# EAGLE design Adafruit SWD Breakout (EAGLE 6.6.0)
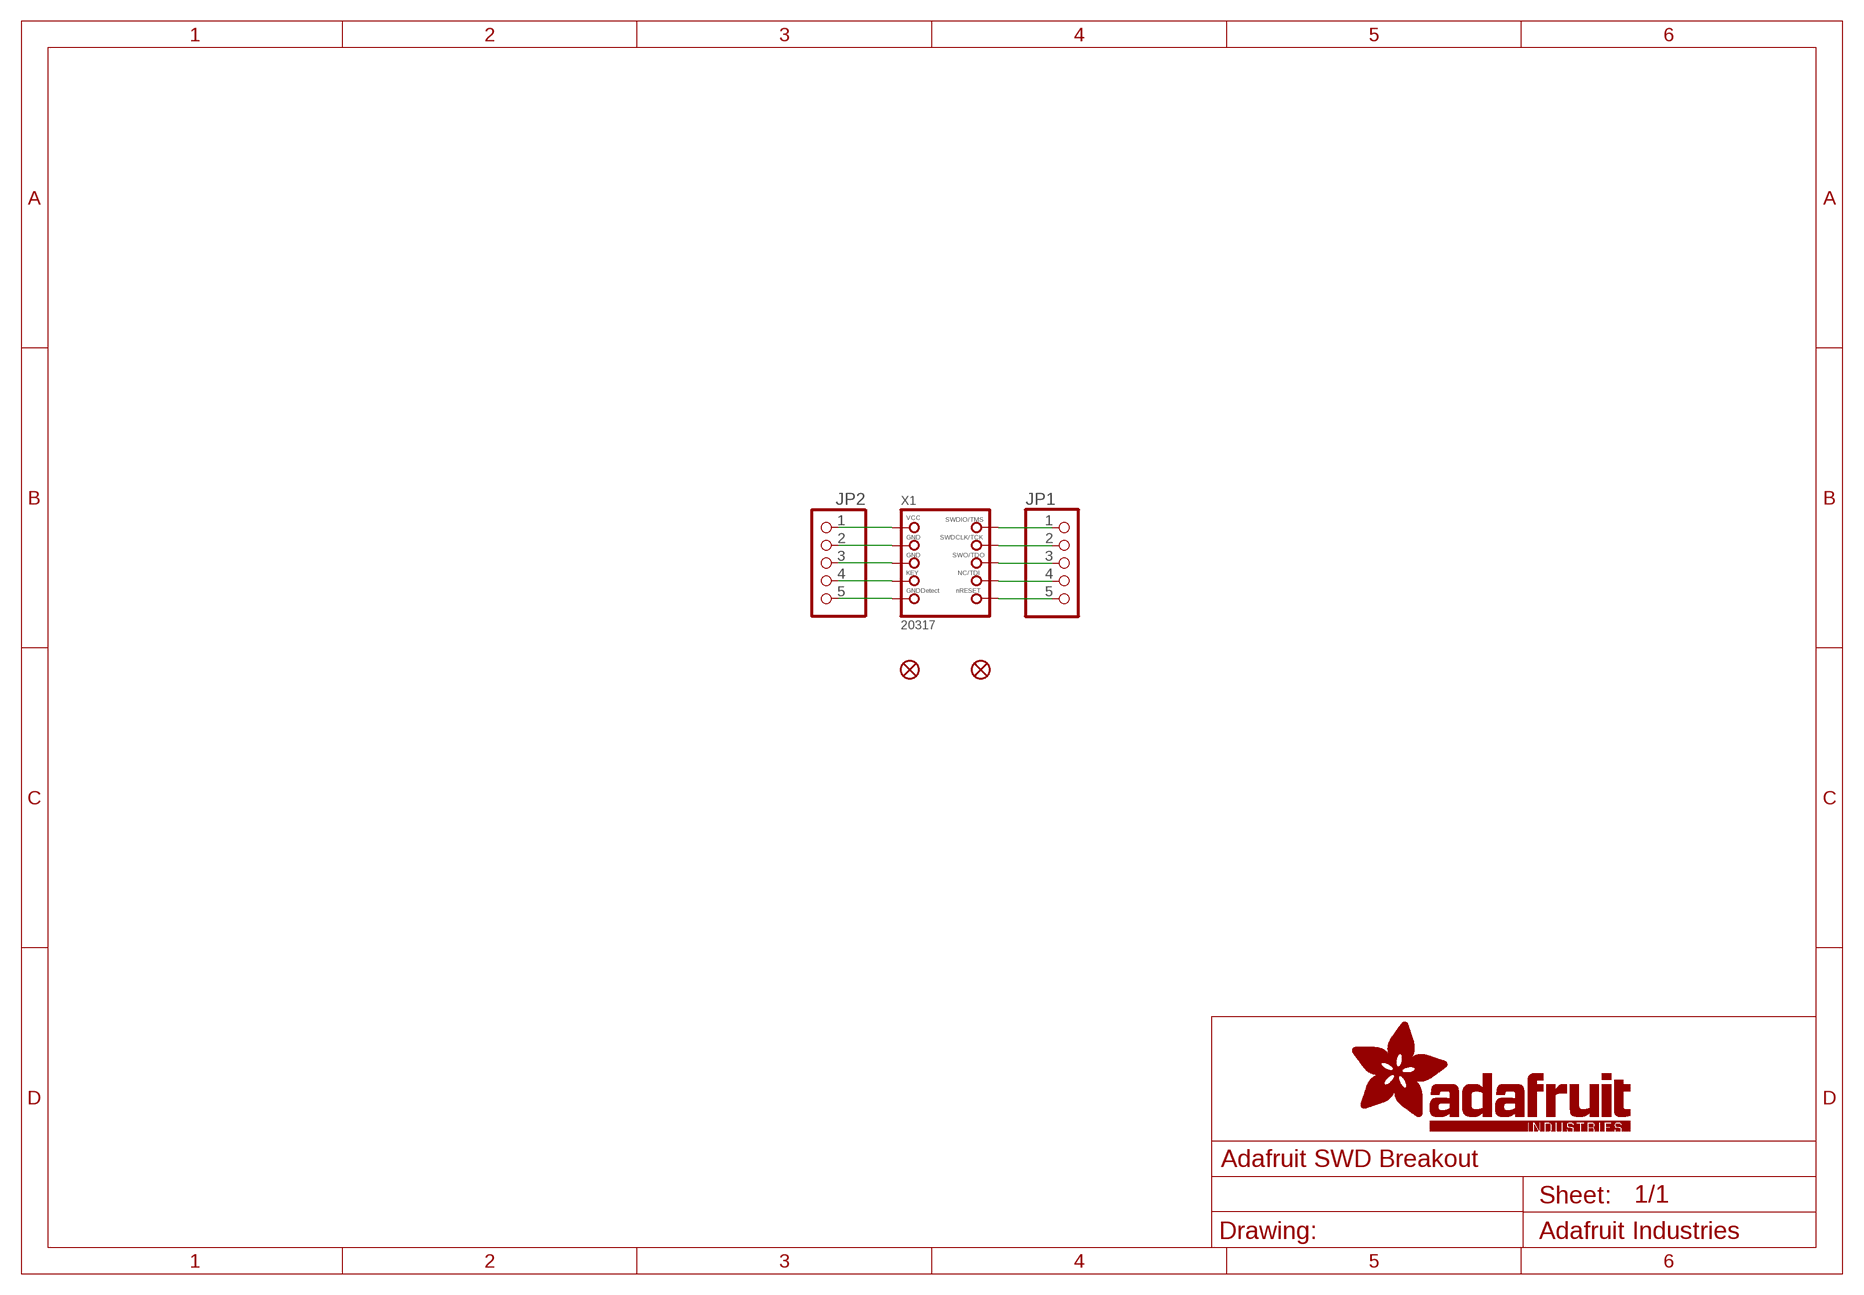
[diagram p0: schematic, sheet 1]

## Parts
FID1  FIDUCIAL""  [FIDUCIAL_1MM]
FID2  FIDUCIAL""  [FIDUCIAL_1MM]
JP1  HEADER-1X576MIL_FULL  [1X05_ROUND_FULL_76]
JP2  HEADER-1X576MIL_FULL  [1X05_ROUND_FULL_76]
X1  20317  JTAG-CORTEXBOXPOSTS  [2X05_1.27MM_BOX_POSTS]

## Nets
N$1: JP2.1 X1.1(VCC)
N$2: JP2.2 X1.3(GND)
N$3: JP2.3 X1.5(GND)
N$4: JP2.4 X1.7(KEY)
N$5: JP2.5 X1.9(GNDDETECT)
N$6: JP1.1 X1.2(SWDIO)
N$7: JP1.2 X1.4(SWDCLK)
N$8: JP1.3 X1.6(SWO)
N$9: JP1.4 X1.8(TDI)
N$10: JP1.5 X1.10(NRESET)

## Library data of the parts
FID1 FID2 = microbuilder:FIDUCIAL: Fiducial Alignment Points Various fiducial points for machine vision alignment.; BOM: EXCLUDE
JP1 JP2 = microbuilder:HEADER-1X5: PIN HEADER
X1 = microbuilder:JTAG-CORTEX: Serial Wire (SW-DP) Connector Standard 0.05" 10-pin connector is for use with the Cortex M and Cortex A SWD (serial wire debugger) interface (SW-DP) Connectors 2x05_1.27MM_SMT - Inexpensive surface-mount header with bare pins, compatible with standard 10-pin SWD cables (4UCON: 16846) 2x05_1.27MM_BOX_NOPOSTS - Polarised surface-mount box (4UCON with caps: 19735, without caps: 15117 2x05_1.27MM_BOX_POSTS - Polarised surface-mount box with mounting holes (4UCON: 20317) Pinout: http://infocenter.arm.com/help/topic/com.arm.doc.faqs/attached/13634/cortex_debug_connectors.pdf http://www.keil.com/peripherals/coresight/connectors.asp

## Board
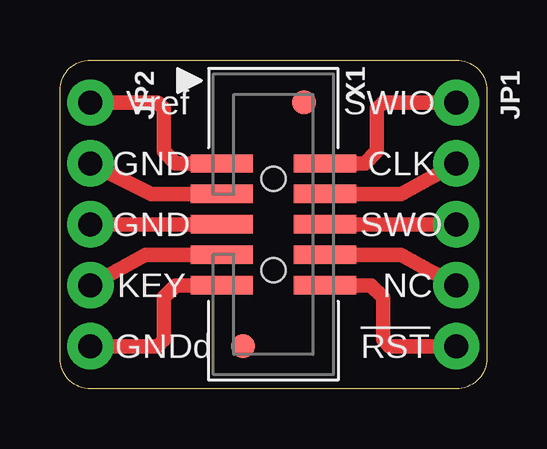
[diagram p1: board, top side]
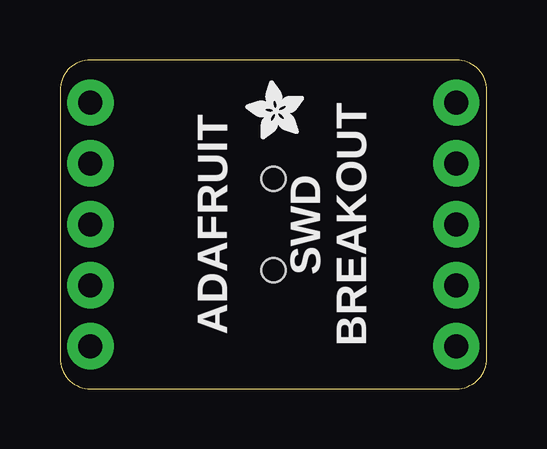
[diagram p2: board, bottom side, seen from below]

Size 17.78 x 13.72 mm. Coordinates in mm from the lower left corner, seen from the top.
Outline: 1.27,13.72 16.51,13.72 arc-90 17.78,12.45 17.78,1.27 arc-90 16.51,0 1.27,0 arc-90 0,1.27 0,12.45 arc-90 1.27,13.72
Copper layers (1*16): Top 0.035mm / dielectric 1.5mm / Bottom 0.035mm
Design rules "adafruit": minimum track width 8mil, minimum drill 15.5mil, track to track 8mil, track to pad 8mil, pad to pad 8mil, via to via 8mil, smd to smd 8mil, copper to edge 10mil, drill to drill 8mil, minimum pad ring 10mil, minimum via ring 8mil, stop-mask expansion 2mil, vias tented up to drill 20mil, thermal gap 10mil

### Footprints (pad centres in the part's own frame; a part is rotated, then mirrored left to right if it is on the bottom)
FIDUCIAL_1MM = smd 1 x 1: 1 0,0
1X05_ROUND_FULL_76 = drill 1 pad 1.93: 1 -5.08,0; 2 -2.54,0; 3 0,0; 4 2.54,0; 5 5.08,0
2X05_1.27MM_BOX_POSTS = smd 0.76 x 2.6: 1 -2.54,-2.15; 2 -2.54,2.15; 3 -1.27,-2.15; 4 -1.27,2.15; 5 0,-2.15; 6 0,2.15; 7 1.27,-2.15; 8 1.27,2.15; 9 2.54,-2.15; 10 2.54,2.15 | hole 1: -1.905,0; 1.905,0

### Placement (x,y rotation side)
FID1  7.62,1.78 270 top
FID2  10.16,11.94 270 top
JP1  16.51,6.86 270 top
JP2  1.27,6.86 270 top
U$2  [ADAFRUIT_2.5MM]  7.62,10.41 90 bottom
X1  8.89,6.86 270 top

### Tracks (layer width: path | path; a pad name or v marks a point on that pad's centre or on a via)
N$1
  Top 0.61: X1.1 4.83,9.4 4.32,9.91 4.32,11.68 4.06,11.94 JP2.1
N$2
  Top 0.61: X1.3 3.81,8.13 JP2.2
N$3
  Top 0.61: X1.5 JP2.3
N$4
  Top 0.61: X1.7 3.56,5.59 JP2.4
N$5
  Top 0.61: X1.9 4.83,4.32 4.32,3.81 4.32,2.03 4.06,1.78 JP2.5
N$6
  Top 0.61: X1.2 12.7,9.4 13.21,9.91 13.21,11.68 13.46,11.94 JP1.1
N$7
  Top 0.61: X1.4 14.22,8.13 JP1.2
N$8
  Top 0.61: X1.6 JP1.3
N$9
  Top 0.61: X1.8 14.22,5.59 JP1.4
N$10
  Top 0.61: X1.10 12.95,4.32 13.46,3.81 13.46,2.03 13.72,1.78 JP1.5

### Text on the board
tPlace: Vref | SWIO | GND | CLK | GND | SWO | KEY | NC | GNDd | !RST
bPlace: SWD / BREAKOUT | ADAFRUIT